# Altium schematic sheet Input-Comparator.SchDoc
size B
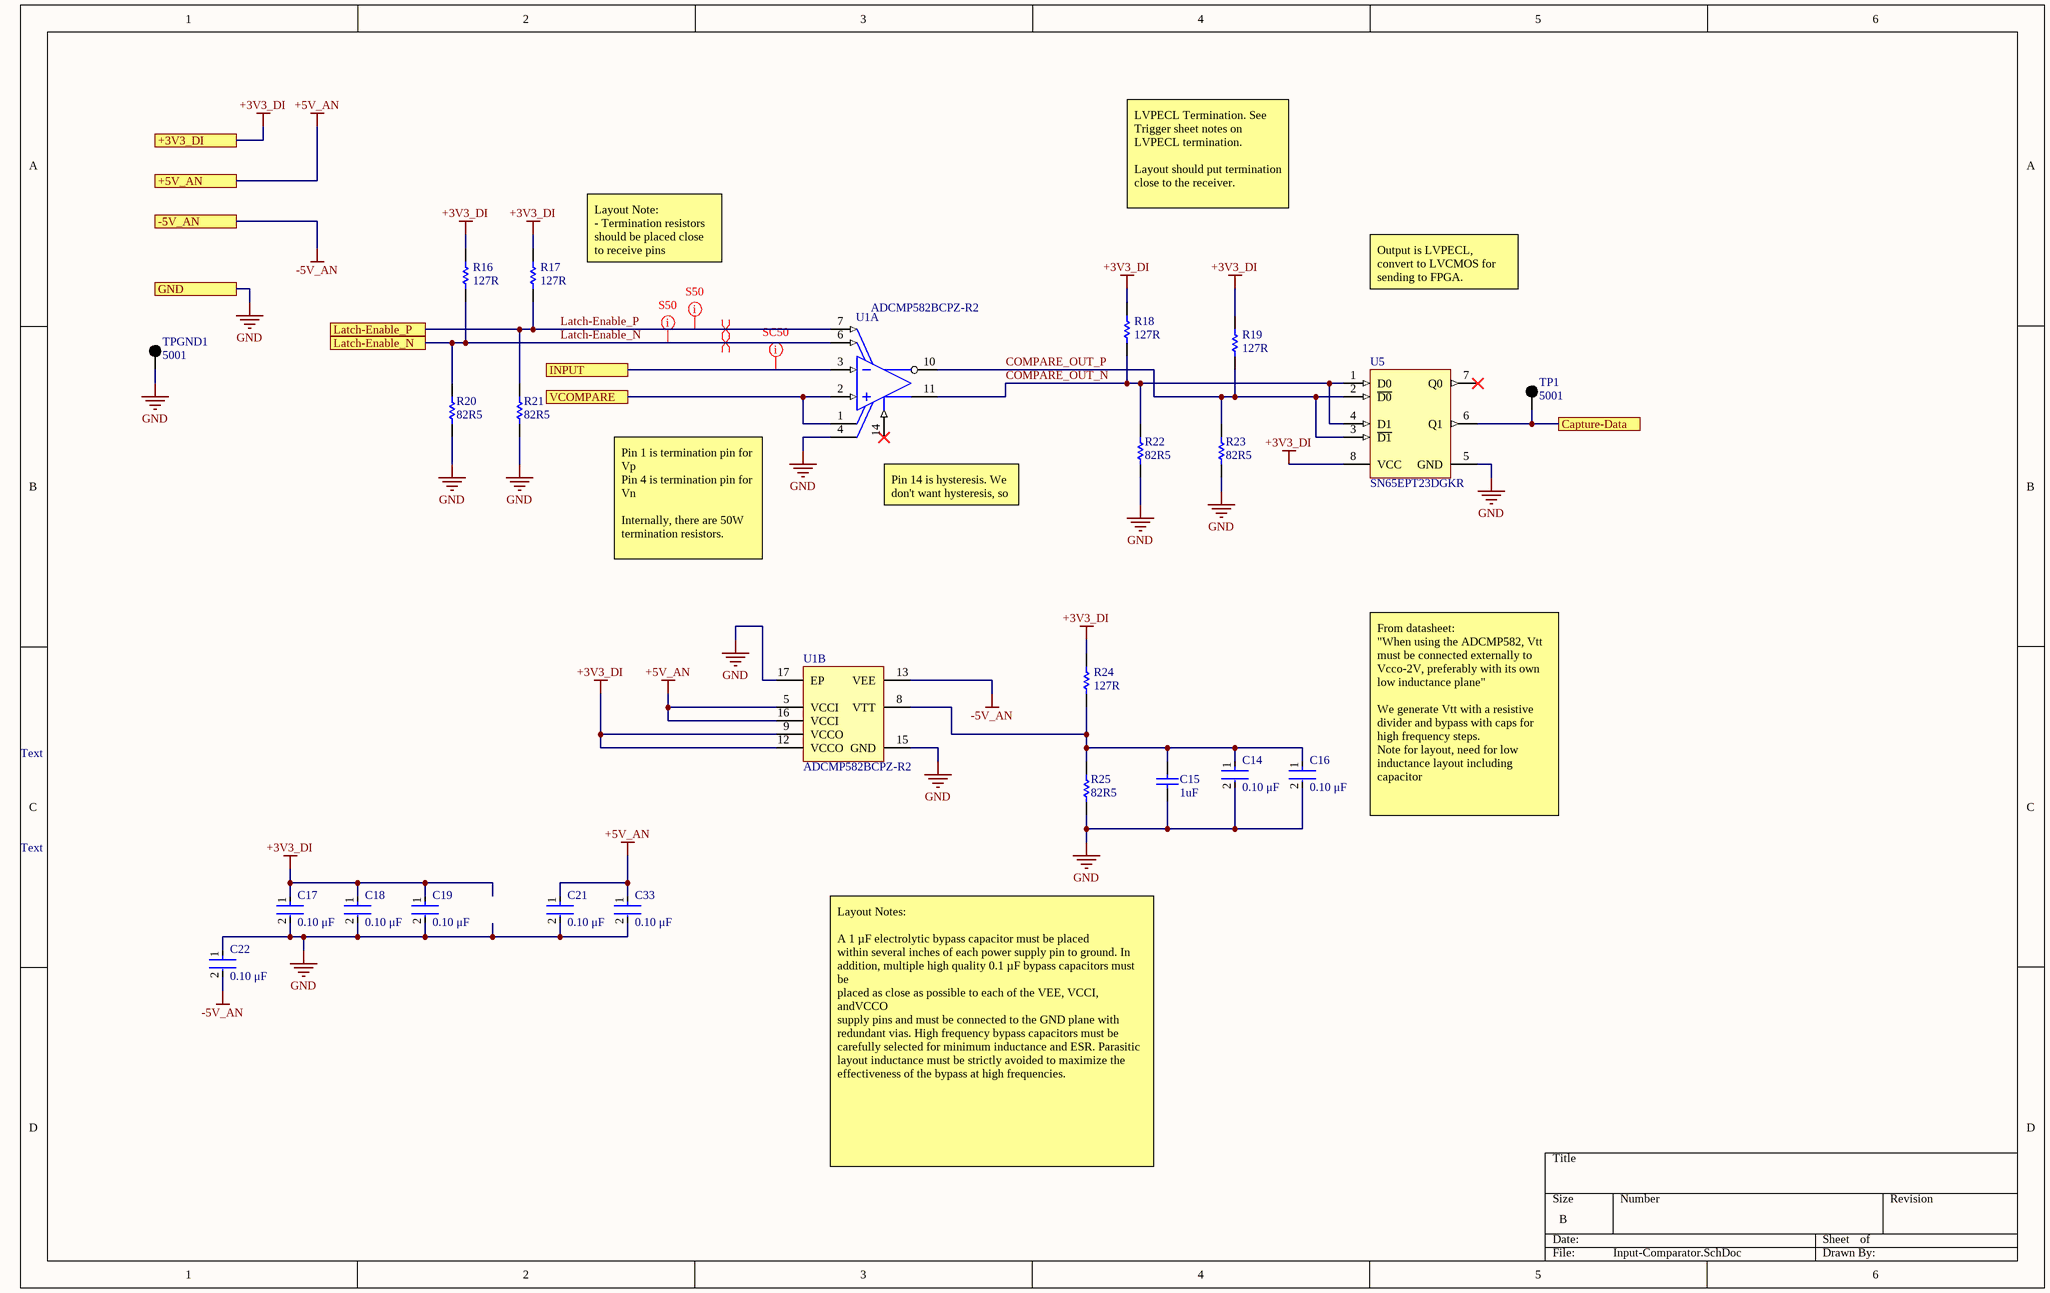
[diagram p0: Input-Comparator.SchDoc]

## Parts
C14  Capacitance: 0.10 μF  [FP-C0402-BB-MFG]  (hidden comment: C0402C104K8PACTU)
C15  1uF  [CAPC2013X100X50NL20T25]
C16  Capacitance: 0.10 μF  [FP-C0402-BB-MFG]  (hidden comment: C0402C104K8PACTU)
C17  Capacitance: 0.10 μF  [FP-C0402-BB-MFG]  (hidden comment: C0402C104K8PACTU)
C18  Capacitance: 0.10 μF  [FP-C0402-BB-MFG]  (hidden comment: C0402C104K8PACTU)
C19  Capacitance: 0.10 μF  [FP-C0402-BB-MFG]  (hidden comment: C0402C104K8PACTU)
C21  Capacitance: 0.10 μF  [FP-C0402-BB-MFG]  (hidden comment: C0402C104K8PACTU)
C22  Capacitance: 0.10 μF  [FP-C0402-BB-MFG]  (hidden comment: C0402C104K8PACTU)
C33  Capacitance: 0.10 μF  [FP-C0402-BB-MFG]  (hidden comment: C0402C104K8PACTU)
R16  value 127R  [RESC1005X40X25LL05T10]  (hidden comment: RC0402FR-07127RL)
R17  value 127R  [RESC1005X40X25LL05T10]  (hidden comment: RC0402FR-07127RL)
R18  value 127R  [RESC1005X40X25LL05T10]  (hidden comment: RC0402FR-07127RL)
R19  value 127R  [RESC1005X40X25LL05T10]  (hidden comment: RC0402FR-07127RL)
R20  value 82R5  [RESC1005X40X25LL05T10]  (hidden comment: RC0402FR-0782R5L)
R21  value 82R5  [RESC1005X40X25LL05T10]  (hidden comment: RC0402FR-0782R5L)
R22  value 82R5  [RESC1005X40X25LL05T10]  (hidden comment: RC0402FR-0782R5L)
R23  value 82R5  [RESC1005X40X25LL05T10]  (hidden comment: RC0402FR-0782R5L)
R24  value 127R  [RESC1005X40X25LL05T10]  (hidden comment: RC0402FR-07127RL)
R25  value 82R5  [RESC1005X40X25LL05T10]  (hidden comment: RC0402FR-0782R5L)
TP1  5001  [KSTN-5001]
TPGND1  5001  [KSTN-5001]
U1  ADCMP582BCPZ-R2  [ADI-CP-16-3_L]  (parts A,B of 2)
U5  SN65EPT23DGKR  [DGK0008A_L]

## Ports
+3V3_DI, +5V_AN, -5V_AN, Capture-Data, GND, INPUT, Latch-Enable_N, Latch-Enable_P, VCOMPARE

## Nets
+3V3_DI: C17.1 C18.1 C19.1 R16.2 R17.2 R18.2 R19.2 R24.2 U1.9(VCCO) U1.12(VCCO) U5.8(VCC) ; port +3V3_DI
+5V_AN: C21.1 C33.1 U1.5(VCCI) U1.16(VCCI) ; port +5V_AN
-5V_AN: C22.2 U1.13(VEE) ; port -5V_AN
GND: C14.2 C15.1 C16.2 C17.2 C18.2 C19.2 C21.2 C22.1 C33.2 R20.1 R21.1 R22.1 R23.1 R25.1 TPGND1.1 U1.4(VTN) U1.15(GND) U1.17(EP) U5.5(GND) ; port GND
Capture-Data: TP1.1 U5.6(Q1) ; port Capture-Data
COMPARE_OUT_N: R18.1 R22.2 U1.11(Q) U5.1(D0) U5.4(D1)
COMPARE_OUT_P: R19.1 R23.2 U1.10(~{Q}) U5.2(~{D0}) U5.3(~{D1})
INPUT: U1.3(VN) ; port INPUT
Latch-Enable_N: R16.1 R20.2 U1.6(~{LE}) ; port Latch-Enable_N
Latch-Enable_P: R17.1 R21.2 U1.7(LE) ; port Latch-Enable_P
VCOMPARE: U1.1(VTP) U1.2(VP) ; port VCOMPARE
NetC14_1: C14.1 C15.2 C16.1 R24.1 R25.2 U1.8(VTT)

Not connected (* = marked no-connect by the designer): U1 14(HYS)*; U5 7(Q0)*

## Layout directives
differential pair: Latch-Enable_N, Latch-Enable_P
net class SC50: INPUT
net class S50: Latch-Enable_N, Latch-Enable_P

## Notes on the sheet
- LVPECL Termination. See Trigger sheet notes on LVPECL termination.
  Layout should put termination close to the receiver.
- Layout Note:
  - Termination resistors should be placed close to receive pins
- Output is LVPECL, convert to LVCMOS for sending to FPGA.
- (near U1) Pin 14 is hysteresis. We don't want hysteresis, so leave unconnected.
- Pin 1 is termination pin for Vp
  Pin 4 is termination pin for Vn
  Internally, there are 50W termination resistors.
- Text
- From datasheet:
  "When using the ADCMP582, Vtt must be connected externally to Vcco-2V, preferably with its own low inductance plane"
  We generate Vtt with a resistive divider and bypass with caps for high frequency steps.
  Note for layout, need for low inductance layout including capacitor
- Layout Notes:
  A 1 µF electrolytic bypass capacitor must be placed
  within several inches of each power supply pin to ground. In
  addition, multiple high quality 0.1 µF bypass capacitors must be
  placed as close as possible to each of the VEE, VCCI, andVCCO
  supply pins and must be connected to the GND plane with
  redundant vias. High frequency bypass capacitors must be
  carefully selected for minimum inductance and ESR. Parasitic
  layout inductance must be strictly avoided to maximize the
  effectiveness of the bypass at high frequencies.

## Library data of the parts
C14 C16-C19 C21 C22 C33 = CMP-2008-02046-2: CAP CER 0.1UF 10V X5R 0402; Manufacturer: Kemet; Material: Ceramic; Temperature Coefficient: 15%; Tolerance: 0.1; Value: 0.10 μF; Package: C0402-BB; Temperature: -55°C to +125°C; ComponentLink2Description: Datasheet; Temperature Characteristic: X5R; Device Class L1: Passive Components; Height: 0.55mm; Lead Free: Yes; ComponentLink2URL: https://content.kemet.com/datasheets/KEM_C1002_X7R_SMD.pdf; Device Class L2: Capacitors; Temperature Range Low: -55°C; Temperature Range High: +125°C; RoHS: TRUE; Octopart: https://octopart.com/c0402c104k8pactu-kemet-140039; Automotive: No; Mouser Description: Capacitor 100 nF 10 VDC 0402; Category: Cap; Voltage Rating: 10 V; Digikey Description: CAP CER 0.1UF 10V X5R 0402; Ipc Land Pattern Name: CAPC10050X50; Device Class L3: Ceramic Capacitors; Manufacturer Part Number: C0402C104K8PACTU
C15 = CMP-2007-03716-1: Part Number: C0805X105K3RACTU; Manufacturer: Kemet
R16-R19 R24 = CMP-2002-07170-1: Manufacturer: Yageo / Phycomp; Part Number: RC0402FR-07127RL
R20-R23 R25 = CMP-2002-07819-1: Manufacturer: Yageo / Phycomp; Part Number: RC0402FR-0782R5L
TP1 TPGND1 = CMP-2000-05181-1: Test Point, Black, 1-Pin THD, RoHS, Bulk; Manufacturer: Keystone; Other Names: 5001K; Catalog Drawings: 5000Series; Alternate Color: 5004K-ND / -TESTPOINTPCMINI.040"DYELLOW / 5003K-ND / -TESTPOINTPCMINI.040"DORANGE / 5002K-ND / -TESTPOINTPCMINI.040"DWHITE / 5000K-ND / -TESTPOINTPCMINI.040"DRED; Kits: DKTGRS232C-KIT-ND / -TTLCONVERTER; Online Catalog: ColorCodedTestPoints; Datasheet URL: https://ciiva.com/datasheet-click-2917627?src=ciiva&sig=bd195616; Mounting Type: 0.040"(1.02mm)HoleDiameter; Family: TestPoints; RoHS Information: RoHSComplianceStatement; Datasheet Version: Rev. G, 12/2008; Color: Black; Category: TestandMeasurement; Standard Package: 100; Manufacturer URL: http://www.keyelco.com/; Material: Base,Nylon46,UL94V-0; Type: PCTestPoint,Miniature; Terminal: 0.010"x0.020"(0.25mmx0.51mm)PhosphorBronzeWire,SilverPlated; Series: THM; Packaging: Bulk
U1 = CMP-0783-00019-1: Ultrafast SiGe Voltage Comparator, + / - 5 V, 180 ps Delay, Industrial, 16-pin QFN (CP-16-3), Reel; Manufacturer: Analog Devices; Input Range (V): -2 to 3; Voltage Supply (V): 5 to -5; ComponentLink2URL: http://www.analog.com/static/imported-files/data_sheets/ADCMP580_581_582.pdf; ComponentLink3URL: http://www.analog.com/static/imported-files/packages/PKG_PDF/LFCSP(CP)/CP_16_3.pdf; PartNumber: ADCMP582BCPZ-R2; Mounting Technology: Surface Mount; PackageReference: CP-16-3; PackageDescription: 16-Pin Lead Frame Chip Scale Package, Body 3 x 3 mm, Pitch 0.5 mm; Code_JEDEC: MO-220-VEED-2; ComponentLink1Description: Manufacturer URL; Packing: Reel; ComponentLink4Description: URL Link1; ComponentLink3Description: Package Specification; ComponentLink1URL: http://www.analog.com/en/index.html; ComponentLink2Description: Datasheet; DatasheetVersion: Rev. A; ComponentLink4URL: Product URL:http://www.analog.com/en/special-linear-functions/comparators/adcmp582/products/product.html
U5 = CMP-0327-00168-3: 600 Mbps 3.3 V ECL Differential Receiver with LVPECL, LVDS Input and LVTTL, CMOS Output, 2 Tx and 2 Rx, -40 to +85 degC, 8-pin VSSOP (DGK), Green (RoHS & no Sb/Br); Manufacturer: Texas Instruments; No. of Rx: 2; SubFamily: PECL PHY; Signaling Rate(Mbps): 600; ICC(Max)(mA): 25; xECL: TRUE; ComponentLink1Description: Manufacturer URL; PackageDescription: 8-Pin Thin Small Outline Package 3 x 3 mm Body ,0.65 mm Pitch; ComponentLink3Description: URL Link1; Mounting Technology: Surface Mount; DatasheetVersion: SLLS969A; ComponentLink2URL: http://www.ti.com/general/docs/lit/getliterature.tsp?genericPartNumber=SN65EPT23&fileType=pdf; Output Signal: LVTTL, CMOS; PackageVersion: revE, May-2006; Eco-Plan: Green (RoHS & no Sb/Br); PartNumber: SN65EPT23DGKR; PackageReference: DGK0008A; Input Signal: LVPECL, LVDS; No. of Tx: 2; ComponentLink1URL: http://www.ti.com/; ComponentLink2Description: Datasheet; ComponentLink3URL: SamplesURL:http://www.ti.com/product/sn65ept23#samples